# Altium schematic sheet microcontroller.schdoc
size A4; SheetNumber: 2; SheetTotal: 2
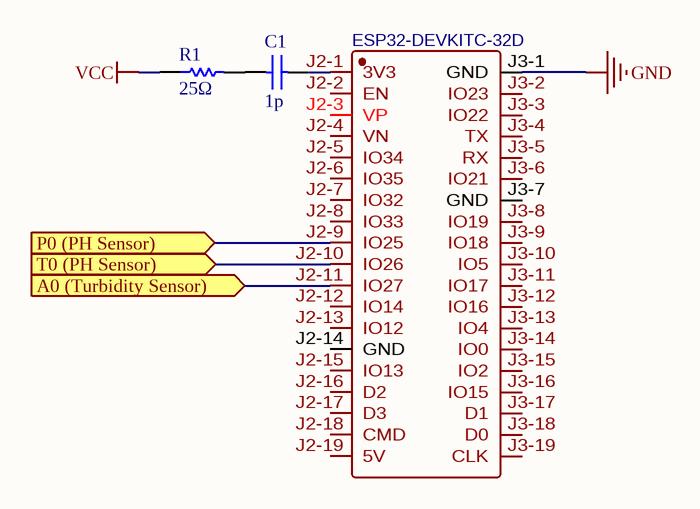
[diagram p0: microcontroller.schdoc]

## Parts
C1  value 1p  (hidden comment: Capacitor)
R1  value 25Ω  (hidden comment: Resistor)
U1  ESP32-DEVKITC-32D  [COMM-SMD_ESP32-DEVKITC-32D]

## Ports
A0 (Turbidity Sensor) (in), P0 (PH Sensor) (in), T0 (PH Sensor) (in)

## Nets
GND: U1.J3-1(GND)
VCC: R1.1
A0 (Turbidity Sensor): U1.J2-11(IO27) ; port A0 (Turbidity Sensor)
P0 (PH Sensor): U1.J2-9(IO25) ; port P0 (PH Sensor)
T0 (PH Sensor): U1.J2-10(IO26) ; port T0 (PH Sensor)
NetC1_1: C1.1 R1.2
NetC1_2: C1.2 U1.J2-1(3V3)

Not connected (* = marked no-connect by the designer): U1 J2-2(EN) J2-3(VP) J2-4(VN) J2-5(IO34) J2-6(IO35) J2-7(IO32) J2-8(IO33) J2-12(IO14) J2-13(IO12) J2-14(GND) J2-15(IO13) J2-16(D2) J2-17(D3) J2-18(CMD) J2-19(5V) J3-2(IO23) J3-3(IO22) J3-4(TX) J3-5(RX) J3-6(IO21) J3-7(GND) J3-8(IO19) J3-9(IO18) J3-10(IO5) J3-11(IO17) J3-12(IO16) J3-13(IO4) J3-14(IO0) J3-15(IO2) J3-16(IO15) J3-17(D1) J3-18(D0) J3-19(CLK)

## Library data of the parts
C1 = Capacitor: SimulationGenericComponent: True
R1 = Resistor: TC1: 0; SimulationGenericComponent: True; TC2: 0
U1 = ESP32-DEVKITC-32D: Manufacturer: ESPRESSIF(乐鑫); Contributor: lcsc; Supplier: LCSC; Supplier Part: C571181; Manufacturer Part: ESP32-DevKitC-32D; JLCPCB Part Class: Extended Part; spicePre: U; spiceSymbolName: ESP32-DEVKITC-32D